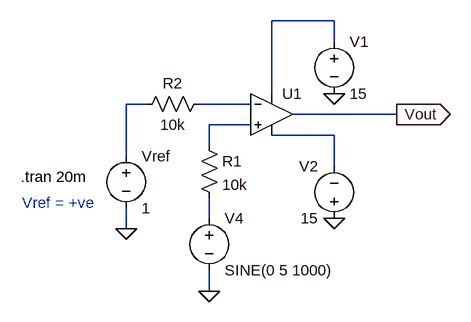
[diagram p0: schematic comparator_posref.asc]
comparator_posref.asc, the LTspice schematic file:
Version 4
SHEET 1 880 680
WIRE 304 0 208 0
WIRE 304 32 304 0
WIRE 208 112 208 0
WIRE 16 128 -16 128
WIRE 176 128 96 128
WIRE 400 144 240 144
WIRE 176 160 112 160
WIRE 304 176 208 176
WIRE 112 192 112 160
WIRE -16 208 -16 128
WIRE 304 224 304 176
WIRE 112 304 112 272
WIRE -16 320 -16 288
WIRE 112 416 112 384
FLAG 304 112 0
FLAG 304 304 0
FLAG 400 144 Vout
IOPIN 400 144 Out
FLAG -16 320 0
FLAG 112 416 0
SYMBOL OpAmps\\UniversalOpamp2 208 144 R0
SYMATTR InstName U1
SYMBOL voltage 304 16 R0
WINDOW 123 0 0 Left 0
WINDOW 39 0 0 Left 0
SYMATTR InstName V1
SYMATTR Value 15
SYMBOL voltage 304 320 R180
WINDOW 0 24 96 Left 2
WINDOW 3 24 16 Left 2
WINDOW 123 0 0 Left 0
WINDOW 39 0 0 Left 0
SYMATTR InstName V2
SYMATTR Value 15
SYMBOL res 96 176 R0
SYMATTR InstName R1
SYMATTR Value 10k
SYMBOL voltage -16 192 R0
WINDOW 123 0 0 Left 0
WINDOW 39 0 0 Left 0
SYMATTR InstName Vref
SYMATTR Value 1
SYMBOL res 112 112 R90
WINDOW 0 0 56 VBottom 2
WINDOW 3 32 56 VTop 2
SYMATTR InstName R2
SYMATTR Value 10k
SYMBOL voltage 112 288 R0
WINDOW 123 0 0 Left 0
WINDOW 39 0 0 Left 0
SYMATTR InstName V4
SYMATTR Value SINE(0 5 1000)
TEXT -178 240 Left 2 !.tran 20m
TEXT -176 280 Left 2 ;Vref = +ve

The netlist it stands for:
* comparator_posref.asc
XU1 N004 N003 N001 N005 Vout level.2 Avol=1Meg GBW=10Meg Slew=10Meg ilimit=25m rail=0 Vos=0 phimargin=45 en=0 enk=0 in=0 ink=0 Rin=500Meg  ; pins IN+ IN- V+ V- OUT
V1 N001 0 15
V2 0 N005 15
R1 N004 N006 10k
Vref N002 0 1
R2 N003 N002 10k
V4 N006 0 SINE(0 5 1000)
.tran 20m
* Vref = +ve
.lib UniversalOpamps2.sub
.backanno
.end